# Altium schematic sheet 遥控器拓展板.SchDoc
size A3; Organization: Altium Limited; Address1: L3, 12a Rodborough Rd; Address2: Frenchs Forest; Address3: NSW; Address4: Australia 2086
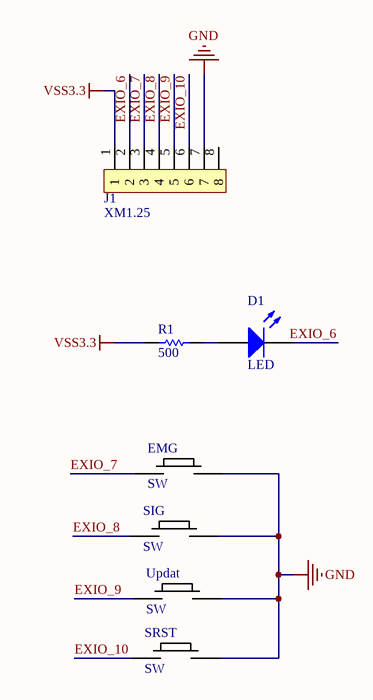
[diagram p0: 遥控器拓展板.SchDoc]

## Parts
D1  LED  [LED 0603]
EMG  SW  [SW SMD 3x6x2.5]
J1  XM1.25  [MX1.25 8P]
R1  500  [R 0603]
SIG  SW  [SW SMD 3x6x2.5]
SRST  SW  [SW SMD 3x6x2.5]
Updat  SW  [SW SMD 3x6x2.5]

## Nets
GND: EMG.2 J1.7 SIG.2 SRST.2 Updat.2
VSS3.3: J1.1 R1.1
EXIO_6: D1.2(K) J1.2
EXIO_7: EMG.1 J1.3
EXIO_8: J1.4 SIG.1
EXIO_9: J1.5 Updat.1
EXIO_10: J1.6 SRST.1
NetD1_1: D1.1(A) R1.2

Not connected (* = marked no-connect by the designer): J1 8

## Notes on the sheet
- Title
- Size:
- Date:
- A3
- Number:
- Time:
- Revision:
- Sheet
- of
- File:

## Library data of the parts
D1 = LED: Typical INFRARED GaAs LED; Published: 8-Jun-2000; LatestRevisionDate: 08-Jul-2005; LatestRevisionNote: Mech Layer 1 removed.; PackageReference: LED-0; Publisher: Altium Limited; PackageDescription: LED; 2 Leads
EMG SIG SRST Updat = 弹簧开关
J1 = 1X8排针: pin to pad: 1>8 2>7 3>6 4>5 5>4 6>3 7>2 8>1
R1 = Res: Resistor; Published: 8-Jun-2000; LatestRevisionDate: 17-Jul-2002; LatestRevisionNote: Re-released for DXP Platform.; PackageReference: AXIAL-0.3; Publisher: Altium Limited; PackageDescription: Axial Device, Thru-Hole; 2 Leads; 0.3 in Pin Spacing